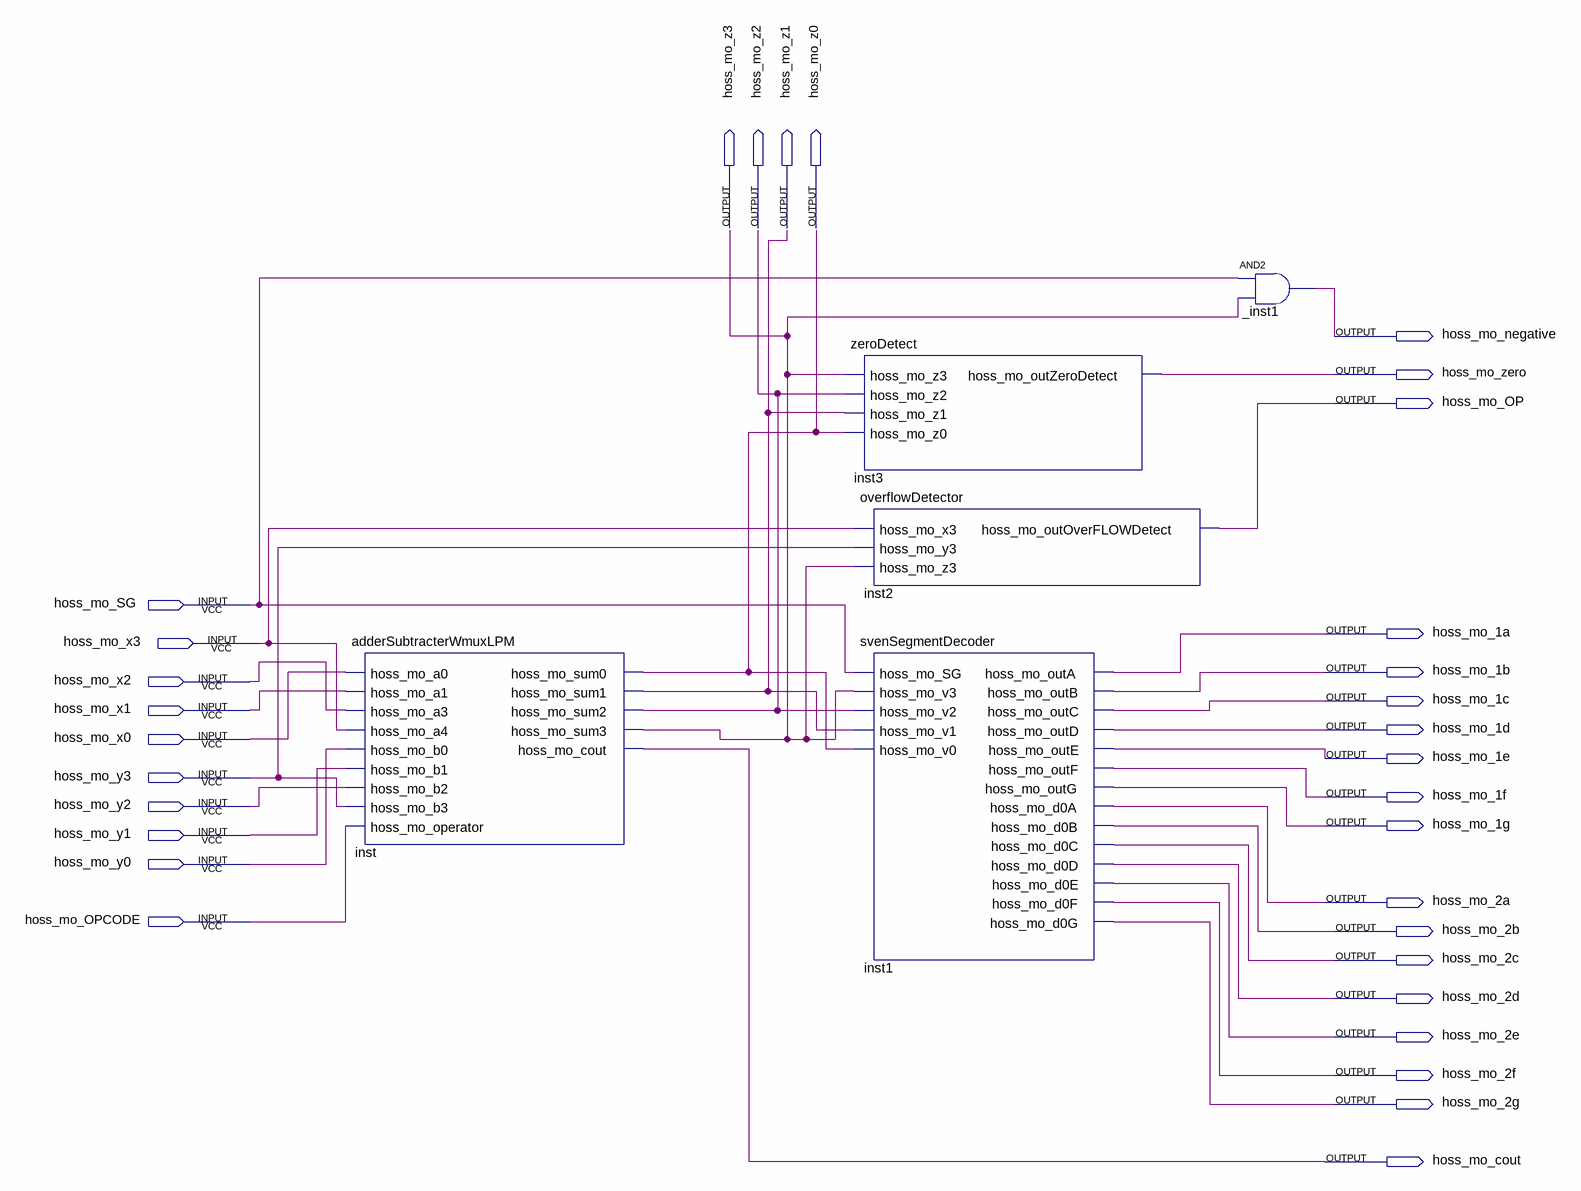
[diagram p0: schematic sheet]
// Quartus schematic finalCircuit.bdf as structural Verilog: 5 symbols, 32 pins
module finalCircuit (
  input  hoss_mo_SG,
  input  hoss_mo_x3,
  input  hoss_mo_x2,
  input  hoss_mo_x1,
  input  hoss_mo_x0,
  input  hoss_mo_y3,
  input  hoss_mo_y2,
  input  hoss_mo_y1,
  input  hoss_mo_y0,
  input  hoss_mo_OPCODE,
  output hoss_mo_z3,
  output hoss_mo_z2,
  output hoss_mo_z1,
  output hoss_mo_z0,
  output hoss_mo_negative,
  output hoss_mo_zero,
  output hoss_mo_OP,
  output hoss_mo_1a,
  output hoss_mo_1b,
  output hoss_mo_1c,
  output hoss_mo_1d,
  output hoss_mo_1e,
  output hoss_mo_1f,
  output hoss_mo_1g,
  output hoss_mo_2a,
  output hoss_mo_2b,
  output hoss_mo_2c,
  output hoss_mo_2d,
  output hoss_mo_2e,
  output hoss_mo_2f,
  output hoss_mo_2g,
  output hoss_mo_cout
);

  adderSubtracterWmuxLPM inst (
    .hoss_mo_a0(hoss_mo_x0), .hoss_mo_a1(hoss_mo_x1), .hoss_mo_a3(hoss_mo_x2), .hoss_mo_a4(hoss_mo_x3),
    .hoss_mo_b0(hoss_mo_y0), .hoss_mo_b1(hoss_mo_y1), .hoss_mo_b2(hoss_mo_y2), .hoss_mo_b3(hoss_mo_y3),
    .hoss_mo_operator(hoss_mo_OPCODE), .hoss_mo_sum0(hoss_mo_z0), .hoss_mo_sum1(hoss_mo_z1),
    .hoss_mo_sum2(hoss_mo_z2), .hoss_mo_sum3(hoss_mo_z3), .hoss_mo_cout(hoss_mo_cout));
  zeroDetect inst3 (
    .hoss_mo_z3(hoss_mo_z3), .hoss_mo_z2(hoss_mo_z2), .hoss_mo_z1(hoss_mo_z1), .hoss_mo_z0(hoss_mo_z0),
    .hoss_mo_outZeroDetect(hoss_mo_zero));
  overflowDetector inst2 (
    .hoss_mo_x3(hoss_mo_x3), .hoss_mo_y3(hoss_mo_y3), .hoss_mo_z3(hoss_mo_z3),
    .hoss_mo_outOverFLOWDetect(hoss_mo_OP));
  svenSegmentDecoder inst1 (
    .hoss_mo_SG(hoss_mo_SG), .hoss_mo_v3(hoss_mo_z3), .hoss_mo_v2(hoss_mo_z2), .hoss_mo_v1(hoss_mo_z1),
    .hoss_mo_v0(hoss_mo_z0), .hoss_mo_outA(hoss_mo_1a), .hoss_mo_outB(hoss_mo_1b), .hoss_mo_outC(hoss_mo_1c),
    .hoss_mo_outD(hoss_mo_1d), .hoss_mo_outE(hoss_mo_1e), .hoss_mo_outF(hoss_mo_1f),
    .hoss_mo_outG(hoss_mo_1g), .hoss_mo_d0A(hoss_mo_2a), .hoss_mo_d0B(hoss_mo_2b), .hoss_mo_d0C(hoss_mo_2c),
    .hoss_mo_d0D(hoss_mo_2d), .hoss_mo_d0E(hoss_mo_2e), .hoss_mo_d0F(hoss_mo_2f), .hoss_mo_d0G(hoss_mo_2g));
  and _inst1 (hoss_mo_negative, hoss_mo_SG, hoss_mo_z3);
endmodule
